# EAGLE design Stereo Audio Detector v2 (EAGLE 7.2.0)
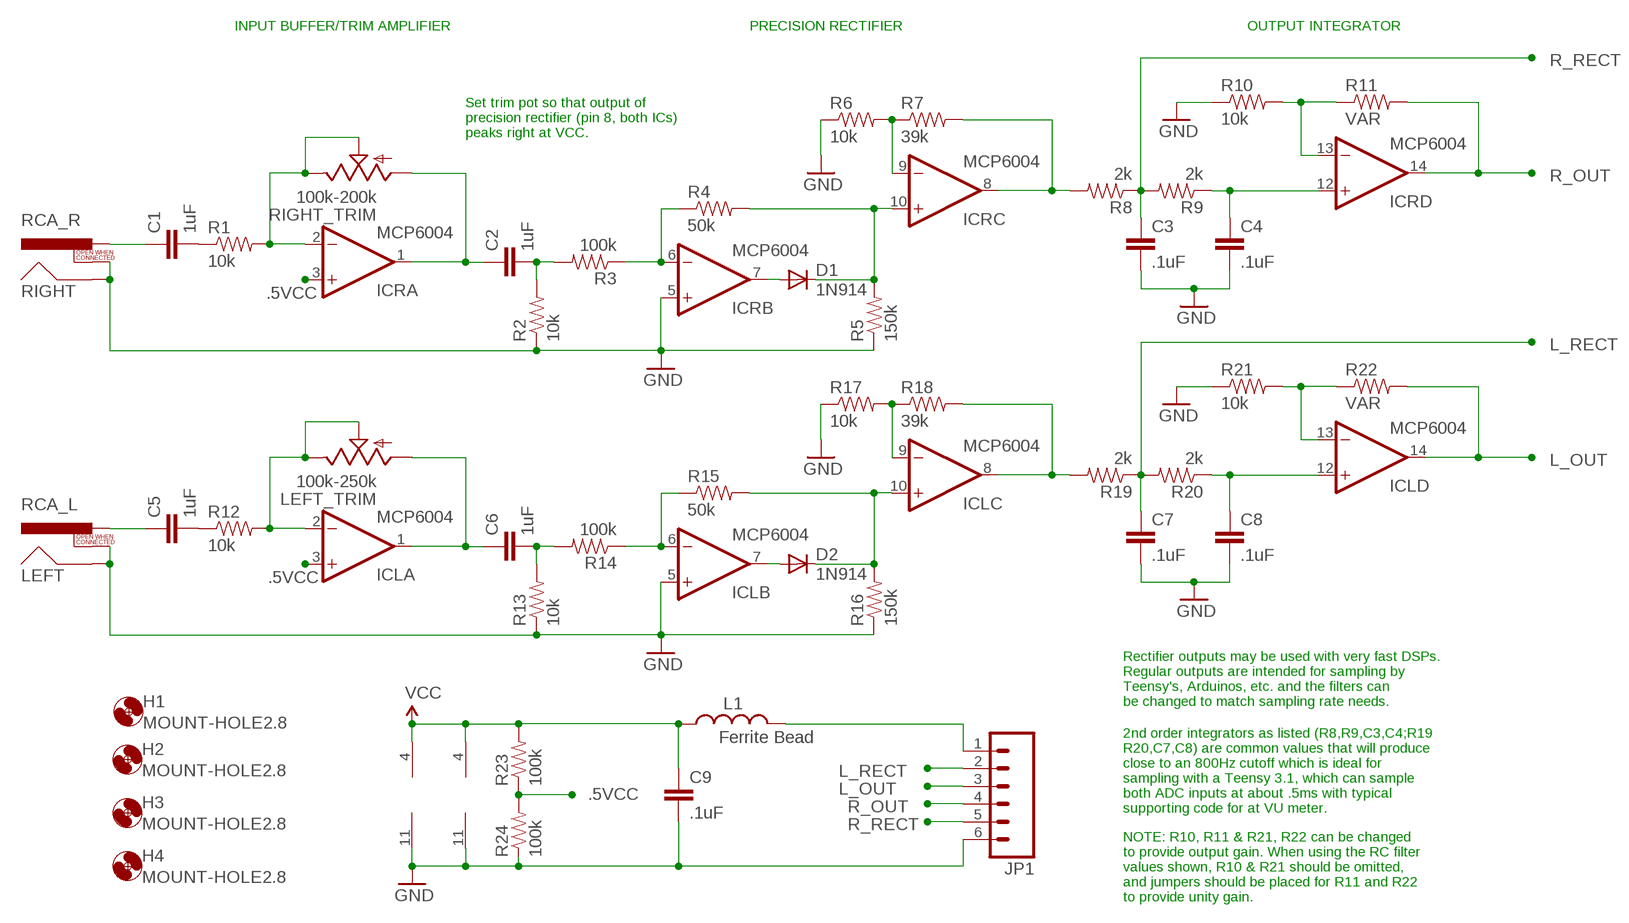
[diagram p0: schematic, sheet 1]

## Parts
C1  1uF  C2.5/2  [C2.5-2]
C2  1uF  C2.5/2  [C2.5-2]
C3  .1uF  C2.5/2  [C2.5-2]
C4  .1uF  C2.5/2  [C2.5-2]
C5  1uF  C2.5/2  [C2.5-2]
C6  1uF  C2.5/2  [C2.5-2]
C7  .1uF  C2.5/2  [C2.5-2]
C8  .1uF  C2.5/2  [C2.5-2]
C9  .1uF  C2.5/2  [C2.5-2]
D1  1N914  DIODE-D-5  [D-5]
D2  1N914  DIODE-D-5  [D-5]
H1  MOUNT-HOLE2.8  [2,8]
H2  MOUNT-HOLE2.8  [2,8]
H3  MOUNT-HOLE2.8  [2,8]
H4  MOUNT-HOLE2.8  [2,8]
ICL  MCP6004  MCP604P  [DIL14]
ICR  MCP6004  MCP604P  [DIL14]
JP1  M06SIP  [1X06]
L1  Ferrite Bead  FERRITE_BEAD  [AXIAL-0.3]
LEFT  RCA_L  RCA  [RCA]
LEFT_TRIM  100k-250k  TRIM_US-CT6  [CT6]
R1  10k  RESISTORAXIAL-0.3  [AXIAL-0.3]
R2  10k  RESISTORAXIAL-0.3  [AXIAL-0.3]
R3  100k  RESISTORAXIAL-0.3  [AXIAL-0.3]
R4  50k  RESISTORAXIAL-0.3  [AXIAL-0.3]
R5  150k  RESISTORAXIAL-0.3  [AXIAL-0.3]
R6  10k  RESISTORAXIAL-0.3  [AXIAL-0.3]
R7  39k  RESISTORAXIAL-0.3  [AXIAL-0.3]
R8  2k  RESISTORAXIAL-0.3  [AXIAL-0.3]
R9  2k  RESISTORAXIAL-0.3  [AXIAL-0.3]
R10  10k  RESISTORAXIAL-0.3  [AXIAL-0.3]
R11  VAR  RESISTORAXIAL-0.3  [AXIAL-0.3]
R12  10k  RESISTORAXIAL-0.3  [AXIAL-0.3]
R13  10k  RESISTORAXIAL-0.3  [AXIAL-0.3]
R14  100k  RESISTORAXIAL-0.3  [AXIAL-0.3]
R15  50k  RESISTORAXIAL-0.3  [AXIAL-0.3]
R16  150k  RESISTORAXIAL-0.3  [AXIAL-0.3]
R17  10k  RESISTORAXIAL-0.3  [AXIAL-0.3]
R18  39k  RESISTORAXIAL-0.3  [AXIAL-0.3]
R19  2k  RESISTORAXIAL-0.3  [AXIAL-0.3]
R20  2k  RESISTORAXIAL-0.3  [AXIAL-0.3]
R21  10k  RESISTORAXIAL-0.3  [AXIAL-0.3]
R22  VAR  RESISTORAXIAL-0.3  [AXIAL-0.3]
R23  100k  RESISTORAXIAL-0.3  [AXIAL-0.3]
R24  100k  RESISTORAXIAL-0.3  [AXIAL-0.3]
RIGHT  RCA_R  RCA  [RCA]
RIGHT_TRIM  100k-200k  TRIM_US-CT6  [CT6]

## Nets
.5VCC: ICL.3(A:+IN) ICR.3(A:+IN) R23.P$1 R24.P$2
GND: C3.2 C4.2 C7.2 C8.2 C9.2 ICL.5(B:+IN) ICL.11(P:V-) ICR.5(B:+IN) ICR.11(P:V-) JP1.6 LEFT.SHELL LEFT.SWITCH R2.P$1 R5.P$1 R6.P$1 R10.P$1 R13.P$1 R16.P$1 R17.P$1 R21.P$1 R24.P$1 RIGHT.SHELL RIGHT.SWITCH
IN_L: C1.1 RIGHT.PIN
IN_R: C5.1 LEFT.PIN
L_OUT: ICL.14(D:OUT) JP1.3 R22.P$2
L_RECT: C7.1 JP1.2 R19.P$1 R20.P$2
N$1: C5.2 R12.P$1
N$2: C1.2 R1.P$1
N$3: JP1.1 L1.P$2
N$5: ICR.2(A:-IN) R1.P$2 RIGHT_TRIM.E RIGHT_TRIM.S
N$6: C2.2 R2.P$2 R3.P$2
N$7: C2.1 ICR.1(A:OUT) RIGHT_TRIM.A
N$8: ICL.2(A:-IN) LEFT_TRIM.E LEFT_TRIM.S R12.P$2
N$9: ICR.6(B:-IN) R3.P$1 R4.P$1
N$10: D1.C ICR.10(C:+IN) R4.P$2 R5.P$2
N$11: ICR.8(C:OUT) R7.P$2 R8.P$2
N$12: ICR.9(C:-IN) R6.P$2 R7.P$1
N$13: D1.A ICR.7(B:OUT)
N$15: C4.1 ICR.12(D:+IN) R9.P$1
N$16: ICR.13(D:-IN) R10.P$2 R11.P$1
N$18: C6.1 ICL.1(A:OUT) LEFT_TRIM.A
N$19: C6.2 R13.P$2 R14.P$2
N$20: ICL.6(B:-IN) R14.P$1 R15.P$1
N$21: ICL.9(C:-IN) R17.P$2 R18.P$1
N$22: ICL.8(C:OUT) R18.P$2 R19.P$2
N$23: D2.A ICL.7(B:OUT)
N$24: D2.C ICL.10(C:+IN) R15.P$2 R16.P$2
N$26: ICL.13(D:-IN) R21.P$2 R22.P$1
N$28: C8.1 ICL.12(D:+IN) R20.P$1
R_OUT: ICR.14(D:OUT) JP1.4 R11.P$2
R_RECT: C3.1 JP1.5 R8.P$1 R9.P$2
VCC: C9.1 ICL.4(P:V+) ICR.4(P:V+) L1.P$1 R23.P$2

## Notes on the sheet
- INPUT BUFFER/TRIM AMPLIFIER | PRECISION RECTIFIER | OUTPUT INTEGRATOR
- Set trim pot so that output of
  precision rectifier (pin 8, both ICs)
  peaks right at VCC.
- Rectifier outputs may be used with very fast DSPs.
  Regular outputs are intended for sampling by
  Teensy's, Arduinos, etc. and the filters can
  be changed to match sampling rate needs.
- 2nd order integrators as listed (R8,R9,C3,C4;R19
  R20,C7,C8) are common values that will produce
  close to an 800Hz cutoff which is ideal for
  sampling with a Teensy 3.1, which can sample
  both ADC inputs at about .5ms with typical
  supporting code for at VU meter.
- NOTE: R10, R11 & R21, R22 can be changed
  to provide output gain. When using the RC filter
  values shown, R10 & R21 should be omitted,
  and jumpers should be placed for R11 and R22
  to provide unity gain.

## Library data of the parts
C1-C9 = capacitor-wima:C: CAPACITOR naming: grid - package width
D1 D2 = diode:DIODE-: DIODE
H1-H4 = holes:MOUNT-HOLE: MOUNTING HOLE with drill center marker
ICL ICR = linear:MCP604: Quad Op Amp 2.7V to 6.0V Single Supply CMOS Source: http://ww1.microchip.com/downloads/en/DeviceDoc/21314g.pdf
JP1 = SparkFun-Connectors:M06: Header 6 Standard 6-pin 0.1" header. Use with straight break away headers (SKU : PRT-00116), right angle break away headers (PRT-00553), swiss pins (PRT-00743), machine pins (PRT-00117), and female headers (PRT-00115). Molex polarized connector foot print use with SKU : PRT-08094 with associated crimp pins and housings. NOTES ON THE VARIANTS LOCK and LOCK_LONGPADS... This footprint was designed to help hold the alignment of a through-hole component (i.e. 6-pin header) while soldering it into place. You may notice that each hole has been shifted either up or down by 0.005 of an inch from it's more standard position (which is a perfectly straight line). This slight alteration caused the pins (the squares in the middle) to touch the edges of the holes. Because they are alternating, it causes a "brace" to hold the component in place. 0.005 has proven to be the perfect amount of "off-center" position when using our standard breakaway headers. Although looks a little odd when you look at the bare footprint, once you have a header in there, the alteration is very hard to notice. Also,if you push a header all the way into place, it is covered up entirely on the bottom side. This idea of altering the position of holes to aid alignment will be further integrated into the Sparkfun Library for other footprints. It can help hold any component with 3 or more connection pins.
L1 = Cort-Library:FERRITE_BEAD
LEFT RIGHT = SparkFun-Connectors:RCA
LEFT_TRIM RIGHT_TRIM = pot:TRIM_US-: POTENTIOMETER
R1-R24 = SparkFun:RESISTOR: Resistor Basic schematic elements and footprints for 0603, 1206, and PTH resistors.

## Board
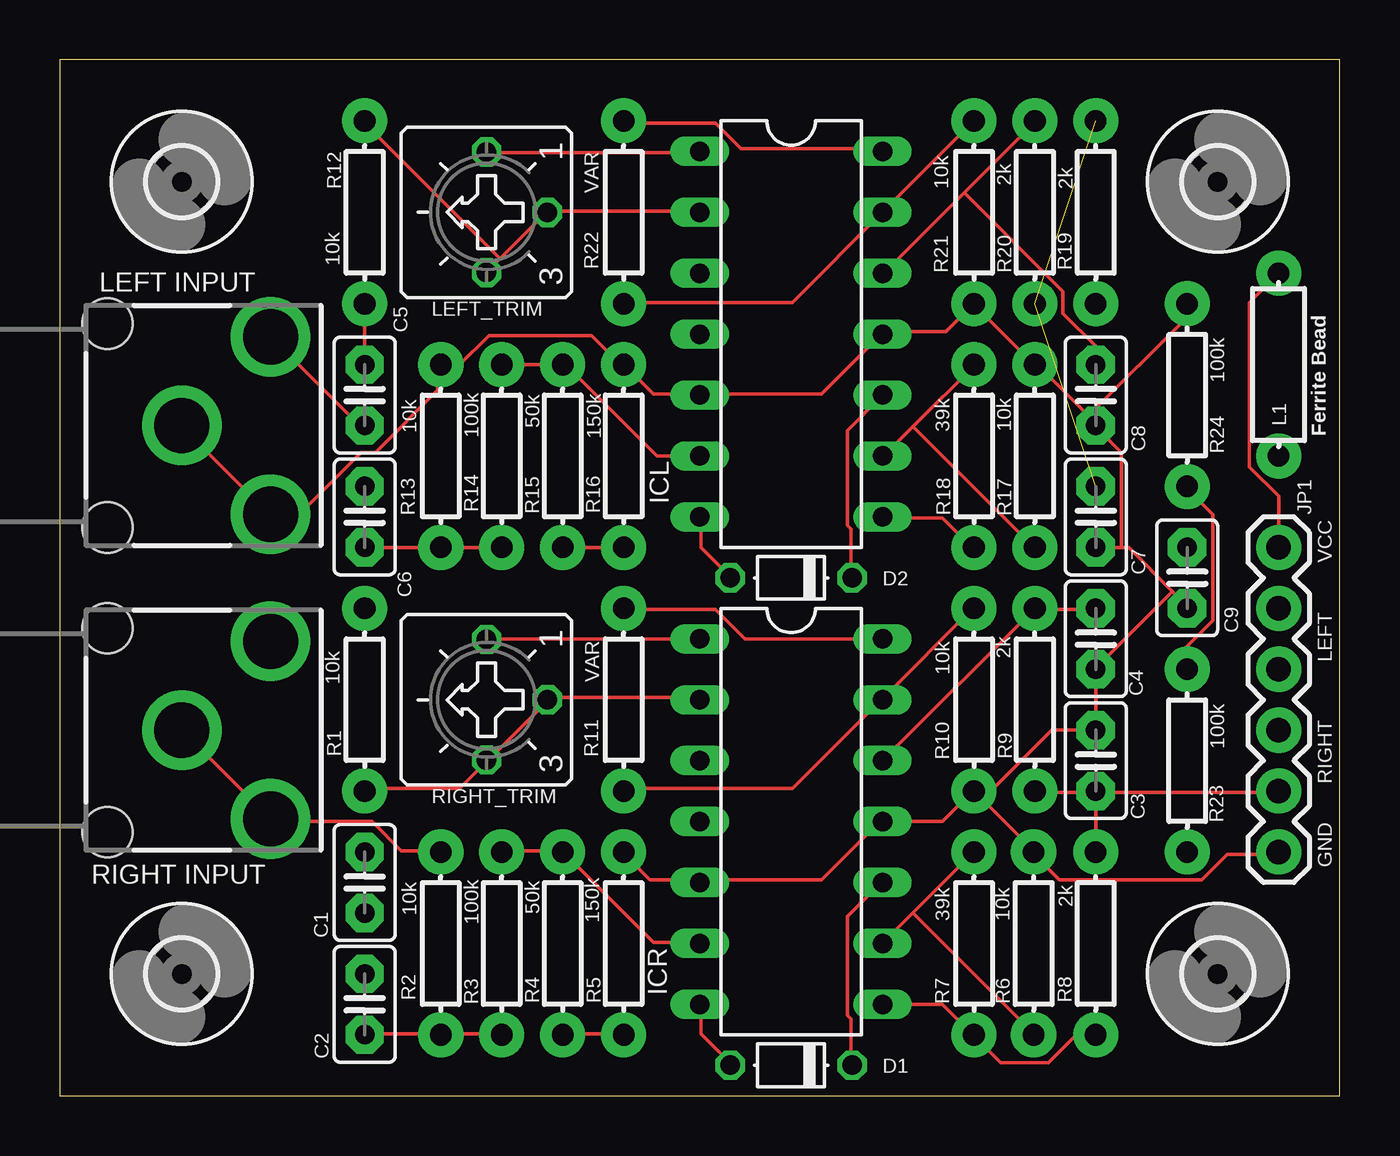
[diagram p1: board, top side]
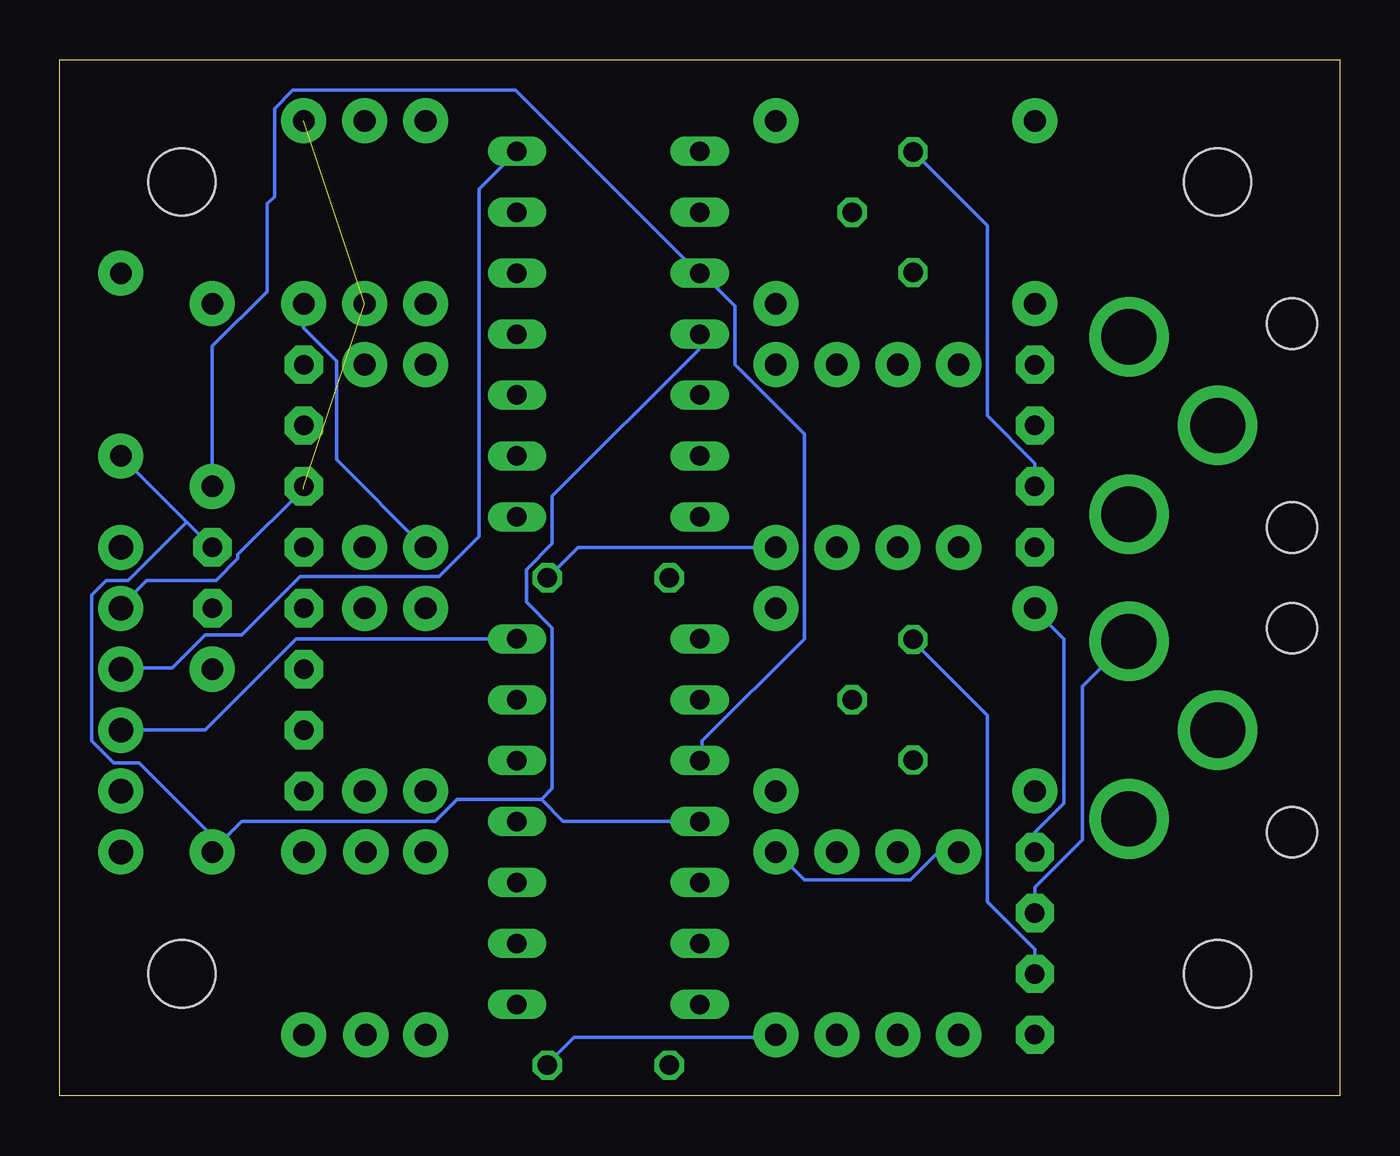
[diagram p2: board, bottom side, seen from below]

Size 53.34 x 43.18 mm. Coordinates in mm from the lower left corner, seen from the top.
Outline: 0,0 53.34,0 53.34,43.18 0,43.18 0,0
Copper layers (1*16): Top 0.0356mm / dielectric 1.5011mm / Bottom 0.0356mm
Design rules "LaenPCBOrder": minimum track width 6mil, minimum drill 13mil, track to track 6mil, track to pad 6mil, pad to pad 6mil, via to via 6mil, smd to smd 6mil, copper to edge 15mil, drill to drill 6mil, minimum pad ring 7mil, minimum via ring 7mil, stop-mask expansion 3mil, vias tented up to drill 0mil, thermal gap 10mil

### Footprints (pad centres in the part's own frame; a part is rotated, then mirrored left to right if it is on the bottom)
C2.5-2 = drill 0.813 pad 1.6 octagon: 1 -1.27,0; 2 1.27,0
D-5 = drill 0.813 octagon: A 2.54,0; C -2.54,0
2,8 = hole 2.8: 0,0
DIL14 = drill 0.813 long: 1 -7.62,-3.81; 2 -5.08,-3.81; 3 -2.54,-3.81; 4 0,-3.81; 5 2.54,-3.81; 6 5.08,-3.81; 7 7.62,-3.81; 8 7.62,3.81; 9 5.08,3.81; 10 2.54,3.81; 11 0,3.81; 12 -2.54,3.81; 13 -5.08,3.81; 14 -7.62,3.81
1X06 = drill 1.016 pad 1.88: 1 0,0; 2 2.54,0; 3 5.08,0; 4 7.62,0; 5 10.16,0; 6 12.7,0
AXIAL-0.3 = drill 0.9 pad 1.88: P$1 -3.81,0; P$2 3.81,0
RCA = drill 2.3: PIN 3.7,3.7; SHELL 0,0; SWITCH 3.7,-3.7 | hole 2.1: -3.1,4.25; -3.1,-4.25
CT6 = drill 0.813 octagon: A 2.515,0; E -2.515,0; S 0,-2.54

### Placement (x,y rotation side)
C1  12.7,8.89 90 top
C2  12.7,3.81 270 top
C3  43.18,13.97 90 top
C4  43.18,19.05 270 top
C5  12.7,29.21 90 top
C6  12.7,24.13 270 top
C7  43.18,24.13 270 top
C8  43.18,29.21 270 top
C9  46.99,21.59 270 top
D1  30.48,1.27 180 top
D2  30.48,21.59 180 top
H1  5.08,38.1 0 top
H2  5.08,5.08 0 top
H3  48.26,38.1 0 top
H4  48.26,5.08 0 top
ICL  30.48,31.75 270 top
ICR  30.48,11.43 270 top
JP1  50.8,22.86 270 top
L1  50.8,30.48 90 top
LEFT  5.08,27.94 0 top
LEFT_TRIM  17.78,36.83 90 top
R1  12.7,16.51 270 top
R2  15.88,6.35 270 top
R3  18.41,6.35 270 top
R4  20.95,6.35 270 top
R5  23.5,6.35 270 top
R6  40.59,6.35 270 top
R7  38.1,6.35 270 top
R8  43.18,6.35 270 top
R9  40.64,16.51 270 top
R10  38.1,16.51 90 top
R11  23.5,16.51 90 top
R12  12.7,36.83 90 top
R13  15.88,26.67 270 top
R14  18.41,26.67 270 top
R15  20.95,26.67 270 top
R16  23.5,26.67 270 top
R17  40.64,26.67 270 top
R18  38.1,26.67 270 top
R19  43.18,36.83 270 top
R20  40.64,36.83 270 top
R21  38.1,36.83 90 top
R22  23.5,36.83 90 top
R23  46.99,13.97 270 top
R24  46.99,29.21 270 top
RIGHT  5.08,15.24 0 top
RIGHT_TRIM  17.78,16.51 90 top

### Tracks (layer width: path | path; a pad name or v marks a point on that pad's centre or on a via)
.5VCC
  Top 0.152: R23.P$1 46.99,18.75 48.06,19.81 48.06,24.23 46.99,25.3 R24.P$2
  Bottom 0.152: ICR.3 26.57,14.02 26.57,14.78 22.3,19.05 22.3,27.58 25.2,30.48 25.2,32.92 26.57,34.29 ICL.3 26.72,34.29 34.34,41.91 43.64,41.91 44.4,41.15 44.4,37.49 44.7,37.19 44.7,33.53 46.99,31.24 R24.P$2
GND
  Top 0.152: R2.P$1 15.75,10.21 14.22,10.21 13,11.43 8.89,11.43 RIGHT.SWITCH RIGHT.SHELL | R5.P$1 23.52,10.06 24.59,8.99 26.57,8.99 ICR.5 26.72,8.99 31.75,8.99 34.19,11.43 ICR.11 36.78,11.43 38,12.65 R10.P$1 | R10.P$1 38.46,12.34 | 38.46,12.34 40.59,10.21 R6.P$1 40.59,10.06 41.66,8.99 47.6,8.99 48.67,10.06 50.8,10.06 JP1.6 | LEFT.SHELL 5.08,27.89 8.74,24.23 LEFT.SWITCH 8.89,24.38 10.11,24.38 12.55,26.82 13.16,26.82 15.75,29.41 15.75,30.48 R13.P$1 16.66,30.48 17.88,31.7 22.15,31.7 23.37,30.48 R16.P$1 23.52,30.48 24.74,29.26 26.57,29.26 ICL.5 26.72,29.26 31.75,29.26 34.19,31.7 ICL.11 34.34,31.85 36.93,31.85 R21.P$1 38.15,32.92 40.59,30.48 R17.P$1 40.74,30.48 42.88,28.35 | 44.25,22.86 44.55,22.86 46.38,21.03 | 44.25,22.86 C7.2 | 46.38,21.03 46.99,20.42 C9.2 | 46.38,21.03 43.18,17.83 C4.2 C3.2 41.35,15.24 38.46,12.34 | 42.88,28.35 43.18,28.04 C8.2 | R24.P$1 46.99,32.46 42.88,28.35 | 42.88,28.35 C8.2 | 44.25,22.86 44.25,26.82 43.18,27.89 C8.2 | 38.15,12.65 R10.P$1
  Bottom 0.152: R2.P$1 15.9,10.06 16.82,10.06 17.88,8.99 22.3,8.99 23.37,10.06 R5.P$1
IN_L
  Bottom 0.152: C1.1 12.7,8.69 10.72,10.67 10.72,17.07 8.89,18.9 RIGHT.PIN
IN_R
  Top 0.152: C5.1 12.7,28.04 12.39,28.04 8.89,31.55 LEFT.PIN
L_OUT
  Top 0.152: ICL.14 34.19,39.47 28.4,39.47 27.33,40.54 23.52,40.54 R22.P$2
  Bottom 0.152: ICL.14 35.87,37.79 35.87,23.32 37.54,21.64 43.33,21.64 45.77,19.2 47.3,19.2 48.67,17.83 50.8,17.83 JP1.3
L_RECT  (3 unrouted)
  Bottom 0.152: 43.18,25.3 45.92,22.55 45.92,22.4 46.84,21.49 49.73,21.49 50.8,20.42 JP1.2
N$1
  Top 0.152: R12.P$1 C5.2
N$2
  Bottom 0.152: C1.2 12.7,10.97 11.48,12.19 11.48,19.05 12.7,20.27 R1.P$1
N$3
  Top 0.152: JP1.1 50.8,24.99 49.58,26.21 49.58,33.07 L1.P$2
N$5
  Top 0.152: ICR.2 26.57,16.61 20.32,16.61 RIGHT_TRIM.S 20.32,16.46 17.88,14.02 RIGHT_TRIM.E 17.73,13.87 16.66,12.8 12.7,12.8 R1.P$2
N$6
  Top 0.152: C2.2 12.7,2.59 15.75,2.59 R2.P$2 15.9,2.59 18.34,2.59 R3.P$2
N$7
  Top 0.152: ICR.1 17.88,19.05 RIGHT_TRIM.A
  Bottom 0.152: C2.1 12.7,6.1 14.68,8.08 14.68,15.85 17.73,18.9 RIGHT_TRIM.A
N$8
  Top 0.152: 20.32,36.88 18.34,34.9 | 18.34,34.9 17.88,34.44 LEFT_TRIM.E | 20.32,36.88 26.57,36.88 ICL.2 | 20.32,36.88 LEFT_TRIM.S | 18.34,34.9 12.7,40.54 R12.P$2
N$9
  Top 0.152: ICR.6 26.57,6.4 24.74,6.4 21.08,10.06 R4.P$1 20.93,10.21 18.49,10.21 R3.P$1
N$10
  Top 0.152: R4.P$2 21.08,2.59 23.37,2.59 R5.P$2 | D1.C 32.97,1.37 32.97,3.2 32.82,3.35 32.82,7.47 34.19,8.84 ICR.10
  Bottom 0.152: R5.P$2 23.52,2.44 31.9,2.44 32.97,1.37 D1.C
N$11
  Top 0.152: ICR.8 36.78,3.81 38,2.59 R7.P$2 38.15,2.44 39.22,1.37 41.2,1.37 42.27,2.44 43.18,2.44 R8.P$2
N$12
  Top 0.152: R7.P$1 35.56,7.62 | 35.56,7.62 ICR.9 | 35.56,7.62 40.59,2.59 R6.P$2
N$13
  Top 0.152: ICR.7 26.72,3.81 26.72,2.59 27.94,1.37 D1.A
N$15
  Top 0.152: ICR.12 R9.P$1 40.74,20.27 43.18,20.27 C4.1
N$16
  Top 0.152: R10.P$2 38,20.27 34.34,16.61 ICR.13 34.19,16.46 30.53,12.8 23.52,12.8 R11.P$1
N$18
  Top 0.152: LEFT_TRIM.A 17.88,39.32 26.57,39.32 ICL.1
  Bottom 0.152: C6.1 12.7,26.37 14.68,28.35 14.68,36.27 17.73,39.32 LEFT_TRIM.A
N$19
  Top 0.152: C6.2 R13.P$2 R14.P$2
N$20
  Top 0.152: ICL.6 24.89,26.67 21.08,30.48 R15.P$1 R14.P$1
N$21
  Top 0.152: 35.56,27.89 38.15,30.48 R18.P$1 | 35.56,27.89 34.34,26.67 ICL.9 | 35.56,27.89 40.59,22.86 R17.P$2
N$22
  Top 0.152: ICL.8 34.34,24.08 36.78,24.08 38,22.86 R18.P$2
  Bottom 0.152: R19.P$2 43.18,32 41.81,30.63 41.81,26.52 38.15,22.86 R18.P$2
N$23
  Top 0.152: ICL.7 26.72,24.08 26.72,22.86 27.94,21.64 D2.A
N$24
  Top 0.152: R16.P$2 R15.P$2 | ICL.10 32.82,27.74 32.82,23.77 32.97,23.62 32.97,21.64 D2.C
  Bottom 0.152: R16.P$2 31.75,22.86 D2.C
N$26
  Top 0.152: R21.P$2 ICL.13 30.53,33.07 23.52,33.07 R22.P$1
N$28
  Top 0.152: 37.69,37.64 40.59,40.54 R20.P$1 | 37.69,37.64 34.34,34.29 ICL.12 | C8.1 43.18,31.24 41.81,32.61 41.81,33.53 37.69,37.64
R_OUT
  Top 0.152: ICR.14 28.55,19.05 27.33,20.27 23.52,20.27 R11.P$2
  Bottom 0.152: JP1.4 47.3,15.24 43.49,19.05 ICR.14
R_RECT
  Top 0.152: 43.18,12.65 40.74,12.65 R9.P$2 | 43.18,12.65 R8.P$1 | 43.18,12.65 50.8,12.65 JP1.5 | 43.18,12.65 C3.1
VCC
  Bottom 0.152: L1.P$1 48.06,23.93 | 48.06,23.93 C9.1 | ICR.4 32.36,11.43 33.27,12.34 | 33.27,12.34 36.78,12.34 37.69,11.43 45.77,11.43 46.69,10.52 | 46.69,10.52 46.99,10.21 R23.P$2 46.69,10.52 | 33.27,12.34 32.82,12.8 32.82,19.51 33.88,20.57 33.88,21.95 32.82,23.01 32.82,24.99 26.72,31.09 26.72,31.7 ICL.4 | 48.06,23.93 50.5,21.49 51.41,21.49 52.02,20.88 52.02,14.78 51.11,13.87 50.04,13.87 46.69,10.52

### Text on the board
tNames: LEFT INPUT | VCC | LEFT | RIGHT | RIGHT INPUT | GND